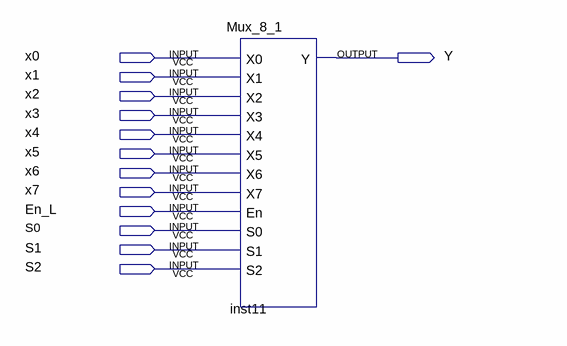
[diagram p0: schematic sheet]
// Quartus schematic MUX.bdf as structural Verilog: 1 symbols, 13 pins
module MUX (
  input  x0,
  input  x1,
  input  x2,
  input  x3,
  input  x4,
  input  x5,
  input  x6,
  input  x7,
  input  En_L,
  input  S0,
  input  S1,
  input  S2,
  output Y
);

  Mux_8_1 inst11 (
    .X0(x0), .X1(x1), .X2(x2), .X3(x3), .X4(x4), .X5(x5), .X6(x6), .X7(x7), .En(En_L), .S0(S0), .S1(S1),
    .S2(S2), .Y(Y));
endmodule
